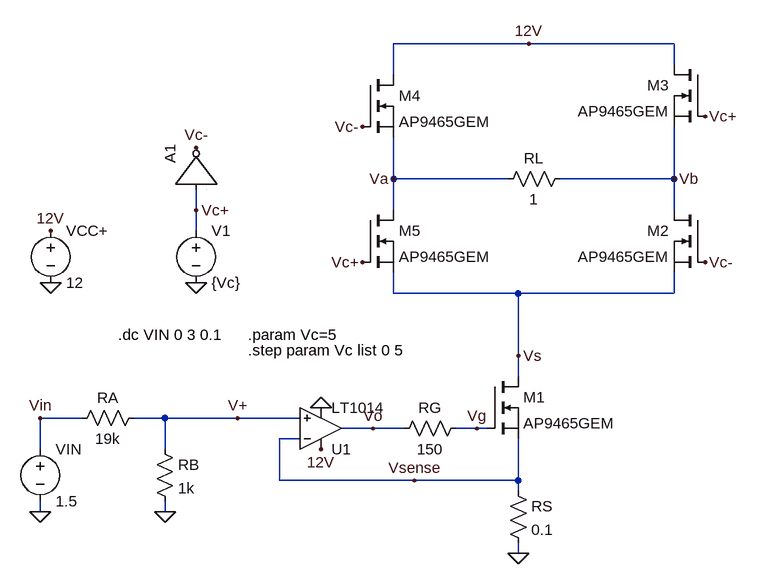
[diagram p0: schematic AmpOpDriverBipolar.asc]
AmpOpDriverBipolar.asc, the LTspice schematic file:
Version 4
SHEET 1 1360 680
WIRE 624 -544 416 -544
WIRE 848 -544 624 -544
WIRE 848 -512 848 -544
WIRE 416 -496 416 -544
WIRE 416 -336 416 -400
WIRE 592 -336 416 -336
WIRE 848 -336 848 -416
WIRE 848 -336 672 -336
WIRE 112 -288 112 -320
WIRE 416 -288 416 -336
WIRE 848 -288 848 -336
WIRE 112 -256 112 -288
WIRE 416 -160 416 -192
WIRE 608 -160 416 -160
WIRE 848 -160 848 -192
WIRE 848 -160 608 -160
WIRE 608 -64 608 -160
WIRE 608 -32 608 -64
WIRE -64 32 -128 32
WIRE 64 32 16 32
WIRE 176 32 64 32
WIRE 272 32 176 32
WIRE 384 48 336 48
WIRE 432 48 384 48
WIRE 544 48 512 48
WIRE 560 48 544 48
WIRE 272 64 240 64
WIRE -128 80 -128 32
WIRE 64 80 64 32
WIRE 240 128 240 64
WIRE 448 128 240 128
WIRE 608 128 608 64
WIRE 608 128 448 128
WIRE 608 144 608 128
WIRE -128 176 -128 160
WIRE 64 176 64 160
WIRE 608 240 608 224
FLAG -128 176 0
FLAG -112 -256 12V
FLAG 304 80 12V
FLAG -128 32 Vin
FLAG 176 32 V+
FLAG 544 48 Vg
FLAG 384 48 Vo
FLAG -112 -176 0
FLAG 608 240 0
FLAG 896 -432 Vc+
FLAG 624 -544 12V
FLAG 448 128 Vsense
FLAG 64 176 0
FLAG 896 -208 Vc-
FLAG 368 -416 Vc-
FLAG 368 -208 Vc+
FLAG 112 -176 0
FLAG 112 -288 Vc+
FLAG 304 16 0
FLAG 608 -64 Vs
FLAG 416 -336 Va
FLAG 848 -336 Vb
FLAG 112 -384 Vc-
SYMBOL voltage -128 64 R0
WINDOW 123 0 0 Left 0
WINDOW 39 0 0 Left 0
SYMATTR InstName VIN
SYMATTR Value 1.5
SYMBOL res 32 16 R90
WINDOW 0 0 56 VBottom 2
WINDOW 3 32 56 VTop 2
SYMATTR InstName RA
SYMATTR Value 19k
SYMBOL res 48 64 R0
SYMATTR InstName RB
SYMATTR Value 1k
SYMBOL OpAmps\\LT1014 304 112 M180
SYMATTR InstName U1
SYMBOL res 592 128 R0
SYMATTR InstName RS
SYMATTR Value 0.1
SYMBOL voltage -112 -272 R0
WINDOW 123 0 0 Left 0
WINDOW 39 0 0 Left 0
SYMATTR InstName VCC+
SYMATTR Value 12
SYMBOL nmos 560 -32 R0
SYMATTR InstName M1
SYMATTR Value AP9465GEM
SYMBOL res 528 32 R90
WINDOW 0 0 56 VBottom 2
WINDOW 3 32 56 VTop 2
SYMATTR InstName RG
SYMATTR Value 150
SYMBOL res 688 -352 R90
WINDOW 0 0 56 VBottom 2
WINDOW 3 32 56 VTop 2
SYMATTR InstName RL
SYMATTR Value 1
SYMBOL nmos 896 -512 M0
SYMATTR InstName M3
SYMATTR Value AP9465GEM
SYMBOL nmos 896 -288 M0
SYMATTR InstName M2
SYMATTR Value AP9465GEM
SYMBOL nmos 368 -496 R0
SYMATTR InstName M4
SYMATTR Value AP9465GEM
SYMBOL nmos 368 -288 R0
SYMATTR InstName M5
SYMATTR Value AP9465GEM
SYMBOL voltage 112 -272 R0
WINDOW 123 0 0 Left 0
WINDOW 39 0 0 Left 0
SYMATTR InstName V1
SYMATTR Value {Vc}
SYMBOL Digital\\inv 48 -320 R270
SYMATTR InstName A1
SYMATTR SpiceLine Vhigh=5 Vlow=0 Ref = 2.5
TEXT -8 -96 Left 2 !.dc VIN 0 3 0.1
TEXT 192 -96 Left 2 !.param Vc=5
TEXT 192 -72 Left 2 !.step param Vc list 0 5

The netlist it stands for:
* AmpOpDriverBipolar.asc
VIN Vin 0 1.5
RA V+ Vin 19k
RB V+ 0 1k
XU1 V+ Vsense 12V 0 Vo LT1014  ; pins In+ In- V+ V- OUT
RS Vsense 0 0.1
VCC+ 12V 0 12
M1 Vs Vg Vsense Vsense AP9465GEM
RG Vg Vo 150
RL Vb Va 1
M3 12V Vc+ Vb Vb AP9465GEM
M2 Vb Vc- Vs Vs AP9465GEM
M4 12V Vc- Va Va AP9465GEM
M5 Va Vc+ Vs Vs AP9465GEM
V1 Vc+ 0 {Vc}
A1 Vc+ 0 0 0 0 Vc- 0 0 BUF Vhigh=5 Vlow=0 Ref = 2.5
.model NMOS NMOS
.model PMOS PMOS
.lib standard.mos
.dc VIN 0 3 0.1
.param Vc=5
.step param Vc list 0 5
.backanno
.end